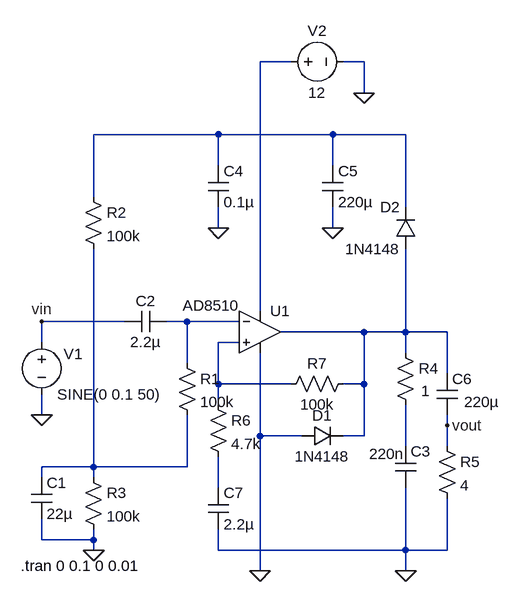
[diagram p0: schematic td2030a amp.asc]
td2030a amp.asc, the LTspice schematic file:
Version 4
SHEET 1 980 680
WIRE 304 -272 256 -272
WIRE 416 -272 384 -272
WIRE 416 -224 416 -272
WIRE 192 -160 0 -160
WIRE 368 -160 192 -160
WIRE 480 -160 368 -160
WIRE 192 -112 192 -160
WIRE 368 -112 368 -160
WIRE 0 -64 0 -160
WIRE 480 -48 480 -160
WIRE 192 -16 192 -48
WIRE 368 -16 368 -48
WIRE 256 112 256 -272
WIRE 48 128 -80 128
WIRE 144 128 112 128
WIRE 224 128 144 128
WIRE 416 144 288 144
WIRE 480 144 480 16
WIRE 480 144 416 144
WIRE 544 144 480 144
WIRE -80 160 -80 128
WIRE 224 160 192 160
WIRE 480 176 480 144
WIRE 144 192 144 128
WIRE 544 208 544 144
WIRE 192 224 192 160
WIRE 304 224 192 224
WIRE 416 224 416 144
WIRE 416 224 384 224
WIRE 192 256 192 224
WIRE -80 272 -80 240
WIRE 544 288 544 272
WIRE 256 304 256 176
WIRE 320 304 256 304
WIRE 416 304 416 224
WIRE 416 304 384 304
WIRE 480 320 480 256
WIRE 544 320 544 288
WIRE 0 352 0 16
WIRE 0 352 -80 352
WIRE 144 352 144 272
WIRE 144 352 0 352
WIRE -80 368 -80 352
WIRE 0 368 0 352
WIRE 192 384 192 336
WIRE -80 464 -80 432
WIRE 0 464 0 448
WIRE 0 464 -80 464
WIRE 0 480 0 464
WIRE 192 480 192 448
WIRE 480 480 480 384
WIRE 480 480 192 480
WIRE 544 480 544 400
WIRE 544 480 480 480
WIRE 256 512 256 304
WIRE 480 512 480 480
FLAG 0 480 0
FLAG 256 512 0
FLAG 192 -16 0
FLAG 368 -16 0
FLAG 480 512 0
FLAG 416 -224 0
FLAG -80 272 0
FLAG -80 128 vin
FLAG 544 288 vout
SYMBOL Opamps\\AD8510 256 80 R0
WINDOW 3 -119 23 Left 2
SYMATTR InstName U1
SYMBOL res 128 176 R0
SYMATTR InstName R1
SYMATTR Value 100k
SYMBOL res -16 -80 R0
SYMATTR InstName R2
SYMATTR Value 100k
SYMBOL res -16 352 R0
SYMATTR InstName R3
SYMATTR Value 100k
SYMBOL res 464 160 R0
WINDOW 3 40 75 Left 2
SYMATTR Value 1
SYMATTR InstName R4
SYMBOL res 528 304 R0
SYMATTR InstName R5
SYMATTR Value 4
SYMBOL res 176 240 R0
SYMATTR InstName R6
SYMATTR Value 4.7k
SYMBOL res 400 208 R90
WINDOW 0 0 56 VBottom 2
WINDOW 3 32 56 VTop 2
SYMATTR InstName R7
SYMATTR Value 100k
SYMBOL cap -96 368 R0
SYMATTR InstName C1
SYMATTR Value 22µ
SYMBOL cap 112 112 R90
WINDOW 0 0 32 VBottom 2
WINDOW 3 32 32 VTop 2
SYMATTR InstName C2
SYMATTR Value 2.2µ
SYMBOL cap 464 320 R0
WINDOW 3 -40 12 Left 2
SYMATTR Value 220n
SYMATTR InstName C3
SYMBOL cap 176 -112 R0
SYMATTR InstName C4
SYMATTR Value 0.1µ
SYMBOL cap 352 -112 R0
SYMATTR InstName C5
SYMATTR Value 220µ
SYMBOL cap 528 208 R0
WINDOW 3 42 44 Left 2
SYMATTR Value 220µ
SYMATTR InstName C6
SYMBOL cap 176 384 R0
SYMATTR InstName C7
SYMATTR Value 2.2µ
SYMBOL diode 320 320 R270
WINDOW 0 32 32 VTop 2
WINDOW 3 0 32 VBottom 2
SYMATTR InstName D1
SYMATTR Value 1N4148
SYMBOL diode 496 16 R180
WINDOW 0 24 64 Left 2
WINDOW 3 24 0 Left 2
SYMATTR InstName D2
SYMATTR Value 1N4148
SYMBOL voltage -80 144 R0
WINDOW 0 34 34 Left 2
WINDOW 123 0 0 Left 0
WINDOW 39 0 0 Left 0
SYMATTR InstName V1
SYMATTR Value SINE(0 0.1 50)
SYMBOL voltage 288 -272 R270
WINDOW 0 32 56 VTop 2
WINDOW 3 -32 56 VBottom 2
WINDOW 123 0 0 Left 0
WINDOW 39 0 0 Left 0
SYMATTR InstName V2
SYMATTR Value 12
TEXT -112 504 Left 2 !.tran 0 0.1 0 0.01

The netlist it stands for:
* td2030a amp.asc
XU1 N005 N003 N001 0 N004 AD8510  ; pins In+ In- V+ V- OUT
R1 N003 N007 100k
R2 N002 N007 100k
R3 N007 0 100k
R4 N004 N006 1
R5 vout 0 4
R6 N005 N008 4.7k
R7 N004 N005 100k
C1 N007 0 22µ
C2 N003 vin 2.2µ
C3 N006 0 220n
C4 N002 0 0.1µ
C5 N002 0 220µ
C6 N004 vout 220µ
C7 N008 0 2.2µ
D1 0 N004 1N4148
D2 N004 N002 1N4148
V1 vin 0 SINE(0 0.1 50)
V2 N001 0 12
.model D D
.lib standard.dio
.tran 0 0.1 0 0.01
.backanno
.end